# Altium schematic sheet Game_Boy_Reverse_Engineering_For_Link_Port.SchDoc
size A
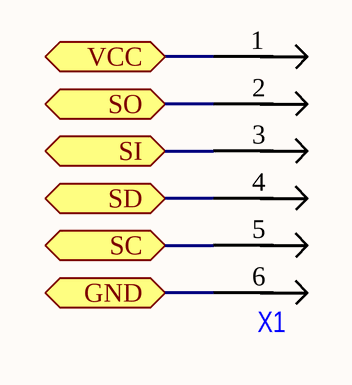
[diagram p0: Game_Boy_Reverse_Engineering_For_Link_Port.SchDoc]

## Parts
X1  (no value)  [PLDR-6]

## Ports
GND, SC, SD, SI, SO, VCC

## Nets
GND: X1.6 ; port GND
SC: X1.5 ; port SC
SD: X1.4 ; port SD
SI: X1.3 ; port SI
SO: X1.2 ; port SO
VCC: X1.1 ; port VCC

## Library data of the parts
X1 = ??: Part number: разъем PLDR-6; ID 1C: ??; Type: разъем